# EAGLE design rf HD (EAGLE 9.0.1)
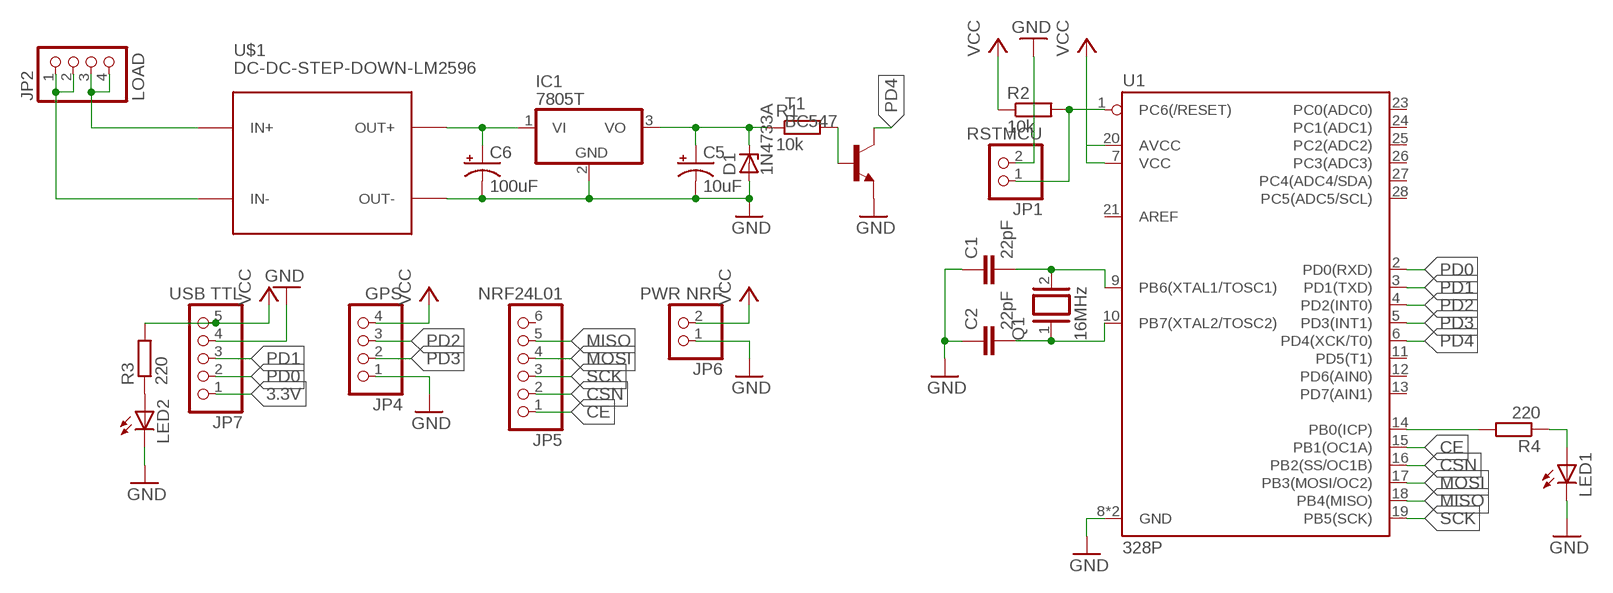
[diagram p0: schematic, sheet 1]

## Parts
C1  22pF  C-EU025-024X044  [C025-024X044]
C2  22pF  C-EU025-024X044  [C025-024X044]
C5  10uF  CPOL-USE2,5-6E  [E2,5-6E]
C6  100uF  CPOL-USE2.5-7  [E2,5-7]
D1  1N4733A  1N4728  [DO41Z10]
IC1  7805T  [TO220H]
JP1  RSTMCU  PINHD-1X2  [1X02]
JP2  LOAD  PINHD-1X4  [1X04]
JP4  GPS  PINHD-1X4  [1X04]
JP5  NRF24L01  PINHD-1X6  [1X06]
JP6  PWR NRF  PINHD-1X2  [1X02]
JP7  USB TTL  PINHD-1X5  [1X05]
LED1  LED3MM  [LED3MM]
LED2  LED3MM  [LED3MM]
Q1  16MHz  XTAL/S  [QS]
R1  10k  R-EU_0207/12  [0207/12]
R2  10k  R-EU_0207/12  [0207/12]
R3  220  R-EU_0207/12  [0207/12]
R4  220  R-EU_0207/12  [0207/12]
T1  BC547  [TO92]
U1  328P  ATMEGA328P_PDIP  [DIP28]
U$1  DC-DC-STEP-DOWN-LM2596  [DC-DC-STEP-DOWN-LM2596]

## Nets
3.3V: JP7.1
CE: JP5.1 U1.15(PB1(OC1A))
CSN: JP5.2 U1.16(PB2(SS/OC1B))
GND: C1.1 C2.1 C5.- C6.- D1.A IC1.2(GND) JP1.2 JP4.1 JP6.1 JP7.4 LED1.K(C) LED2.K(C) T1.1(E) U1.8(GND) U1.22(GND) U$1.OUT-
MISO: JP5.5 U1.18(PB4(MISO))
MOSI: JP5.4 U1.17(PB3(MOSI/OC2))
N$1: C1.2 Q1.2 U1.9(PB6(XTAL1/TOSC1))
N$2: C2.2 Q1.1 U1.10(PB7(XTAL2/TOSC2))
N$3: R1.2 T1.2(B)
N$4: JP1.1 R2.2 U1.1(PC6(/RESET))
N$5: JP2.3 JP2.4 U$1.IN+
N$6: C5.+ D1.C IC1.3(VO) R1.1
N$7: LED2.A R3.1
N$8: LED1.A R4.1
N$10: JP2.1 JP2.2 U$1.IN-
N$11: C6.+ IC1.1(VI) U$1.OUT+
PB0: R4.2 U1.14(PB0(ICP))
PD0: JP7.2 U1.2(PD0(RXD))
PD1: JP7.3 U1.3(PD1(TXD))
PD2: JP4.3 U1.4(PD2(INT0))
PD3: JP4.2 U1.5(PD3(INT1))
PD4: T1.3(C) U1.6(PD4(XCK/T0))
SCK: JP5.3 U1.19(PB5(SCK))
VCC: JP4.4 JP6.2 JP7.5 R2.1 R3.2 U1.7(VCC) U1.20(AVCC)
Unconnected: JP5.6 U1.11(PD5(T1)) U1.12(PD6(AIN0)) U1.13(PD7(AIN1)) U1.21(AREF) U1.23(PC0(ADC0)) U1.24(PC1(ADC1)) U1.25(PC2(ADC2)) U1.26(PC3(ADC3)) U1.27(PC4(ADC4/SDA)) U1.28(PC5(ADC5/SCL))

## Library data of the parts
C1 C2 = rcl:C-EU: CAPACITOR, European symbol; SPICEPREFIX: C
C5 C6 = rcl:CPOL-US: POLARIZED CAPACITOR, American symbol; SPICEPREFIX: C
D1 = diode:1N4728: Z DIODE 3.3 V, 1W, 5 percent
IC1 = linear:78*: Positive VOLTAGE REGULATOR Source: http://cache.national.com/ds/LM/LM78L05.pdf http://www.fairchildsemi.com/ds/LM/LM7805.pdf
JP1 JP6 = pinhead:PINHD-1X2: PIN HEADER
JP2 JP4 = pinhead:PINHD-1X4: PIN HEADER
JP5 = pinhead:PINHD-1X6: PIN HEADER
JP7 = pinhead:PINHD-1X5: PIN HEADER
LED1 LED2 = led:LED: LED OSRAM: - CHIPLED LG R971, LG N971, LY N971, LG Q971, LY Q971, LO R971, LY R971 LH N974, LH R974 LS Q976, LO Q976, LY Q976 LO Q996 - Hyper CHIPLED LW Q18S LB Q993, LB Q99A, LB R99A - SideLED LS A670, LO A670, LY A670, LG A670, LP A670 LB A673, LV A673, LT A673, LW A673 LH A674 LY A675 LS A676, LA A676, LO A676, LY A676, LW A676 LS A679, LY A679, LG A679 - Hyper Micro SIDELED® LS Y876, LA Y876, LO Y876, LY Y876 LT Y87S - SmartLED LW L88C, LW L88S LB L89C, LB L89S, LG L890 LS L89K, LO L89K, LY L89K LS L896, LA L896, LO L896, LY L896 - TOPLED LS T670, LO T670, LY T670, LG T670, LP T670 LSG T670, LSP T670, LSY T670, LOP T670, LYG T670 LG T671, LOG T671, LSG T671 LB T673, LV T673, LT T673, LW T673 LH T674 LS T676, LA T676, LO T676, LY T676, LB T676, LH T676, LSB T676, LW T676 LB T67C, LV T67C, LT T67C, LS T67K, LO T67K, LY T67K, LW E67C LS E67B, LA E67B, LO E67B, LY E67B, LB E67C, LV E67C, LT E67C LW T67C LS T679, LY T679, LG T679 LS T770, LO T770, LY T770, LG T770, LP T770 LB T773, LV T773, LT T773, LW T773 LH T774 LS E675, LA E675, LY E675, LS T675 LS T776, LA T776, LO T776, LY T776, LB T776 LHGB T686 LT T68C, LB T68C - Hyper Mini TOPLED® LB M676 - Mini TOPLED Santana® LG M470 LS M47K, LO M47K, LY M47K Source: http://www.osram.convergy.de LUXEON: - LUMILED® LXK2-PW12-R00, LXK2-PW12-S00, LXK2-PW14-U00, LXK2-PW14-V00 LXK2-PM12-R00, LXK2-PM12-S00, LXK2-PM14-U00 LXK2-PE12-Q00, LXK2-PE12-R00, LXK2-PE12-S00, LXK2-PE14-T00, LXK2-PE14-U00 LXK2-PB12-K00, LXK2-PB12-L00, LXK2-PB12-M00, LXK2-PB14-N00, LXK2-PB14-P00, LXK2-PB14-Q00 LXK2-PR12-L00, LXK2-PR12-M00, LXK2-PR14-Q00, LXK2-PR14-R00 LXK2-PD12-Q00, LXK2-PD12-R00, LXK2-PD12-S00 LXK2-PH12-R00, LXK2-PH12-S00 LXK2-PL12-P00, LXK2-PL12-Q00, LXK2-PL12-R00 Source: www.luxeon.com KINGBRIGHT: KA-3528ASYC Source: www.kingbright.com
Q1 = special:XTAL/S: CRYSTAL
R1-R4 = rcl:R-EU_: RESISTOR, European symbol; SPICEPREFIX: R
T1 = transistor:BC547: NPN TRANSISTOR
U1 = SparkFun-IC-Microcontroller:ATMEGA328P_PDIP: Atmel 328P Through hole ATMEGA328P uC used in the Arduino 32kb flash, 1k EEPROM, 2k SRAM Datasheet <http://www.sparkfun.com/datasheets/Components/SMD/ATMega328.pdf> SparkFun Products Storefront component: AVR 28 Pin 20MHz 32K 6A/D - ATMega328P <https://www.sparkfun.com/products/9061> (COM-09061) SparkFun Simon Says - Through-Hole Soldering Kit <https://www.sparkfun.com/products/10547> (KIT-10547) SparkFun Learn to Solder - Simon Says <https://www.sparkfun.com/products/13708> (KIT-13708) SparkFun BigTime Watch Kit <https://www.sparkfun.com/products/11734> (KIT-11734) SparkFun ClockIt <https://www.sparkfun.com/products/10930> (KIT-10930) SparkFun Serial Enabled LCD Kit <https://www.sparkfun.com/products/10097> (LCD-10097) SparkFun Simon Tilts - Through Hole Soldering Kit <https://www.sparkfun.com/products/12634> (KIT-12634) SparkFun Frequency Counter Kit <https://www.sparkfun.com/products/10140> (KIT-10140) FabFM Radio Kit <https://www.sparkfun.com/products/11043> (KIT-11043) SparkFun Binary Blaster Kit <https://www.sparkfun.com/products/12037> (KIT-12037) SparkFun Metro-Gnome <https://www.sparkfun.com/products/9236> (KIT-09236) ATmega328 with Arduino Optiboot (Uno) <https://www.sparkfun.com/products/10524> (DEV-10524); PROD_ID: IC-09136
U$1 = diy-modules:DC-DC-STEP-DOWN-LM2596: DC/DC Step-Down Regulator based on LM2596-ADJ chip LM2596 datasheet available here: http://www.ti.com/lit/ds/symlink/lm2596.pdf Click here to find device on ebay.com <http://www.ebay.com/sch/lm2596+power+regulator>

## Board
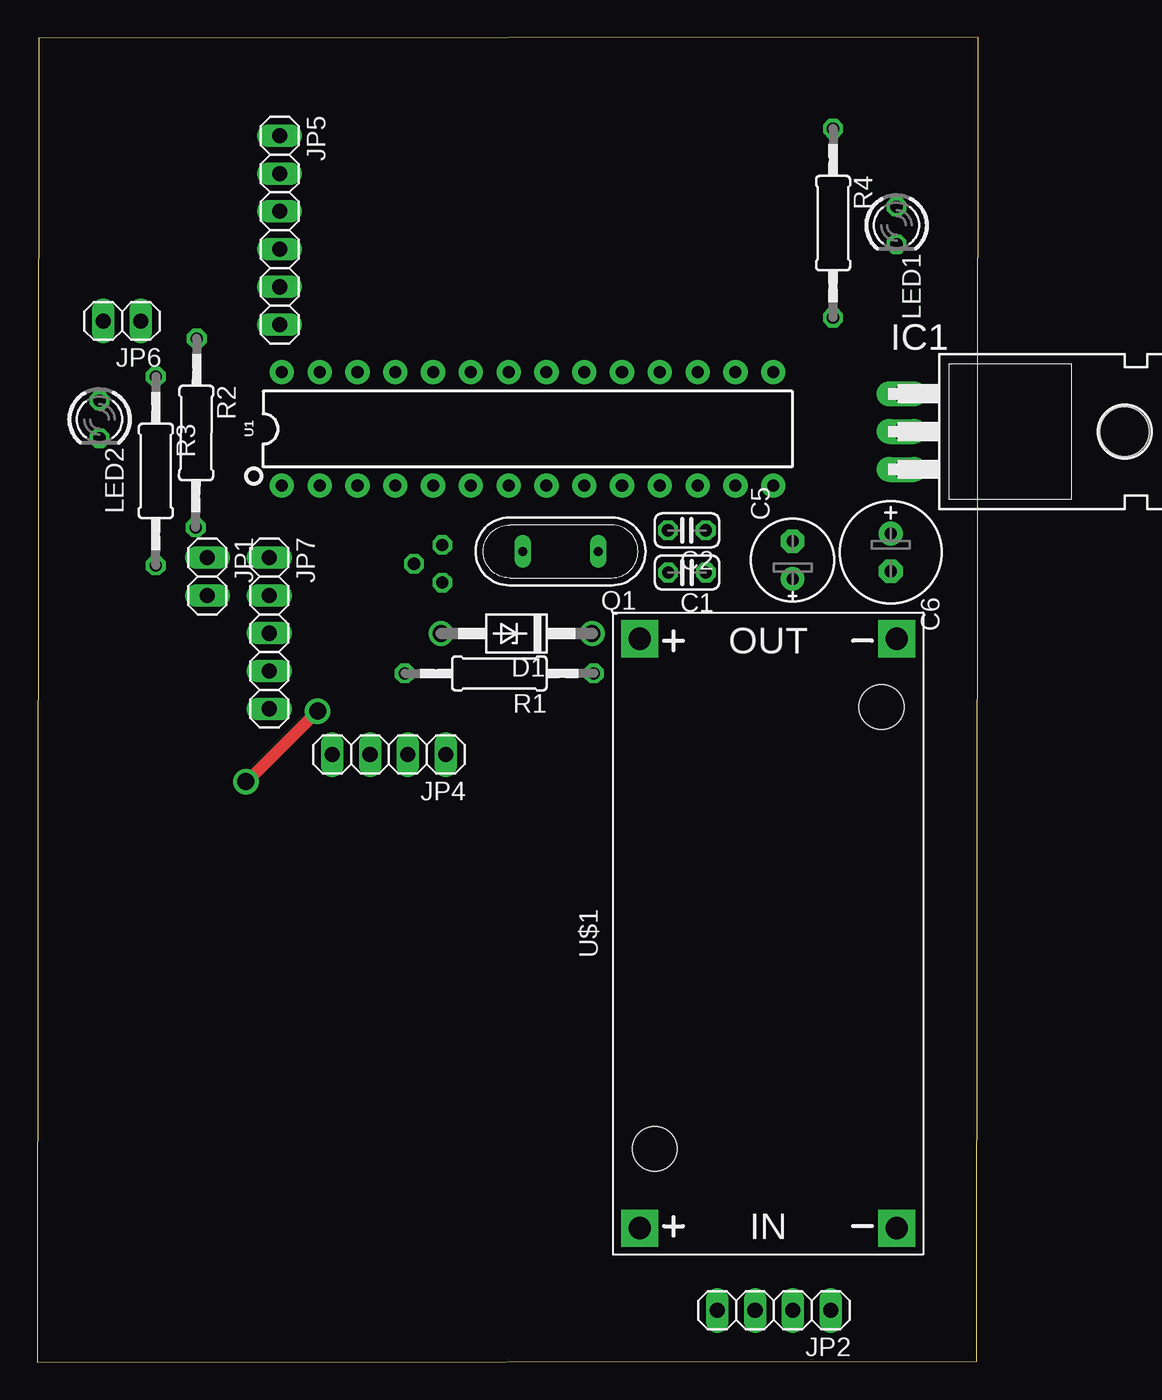
[diagram p1: board, top side]
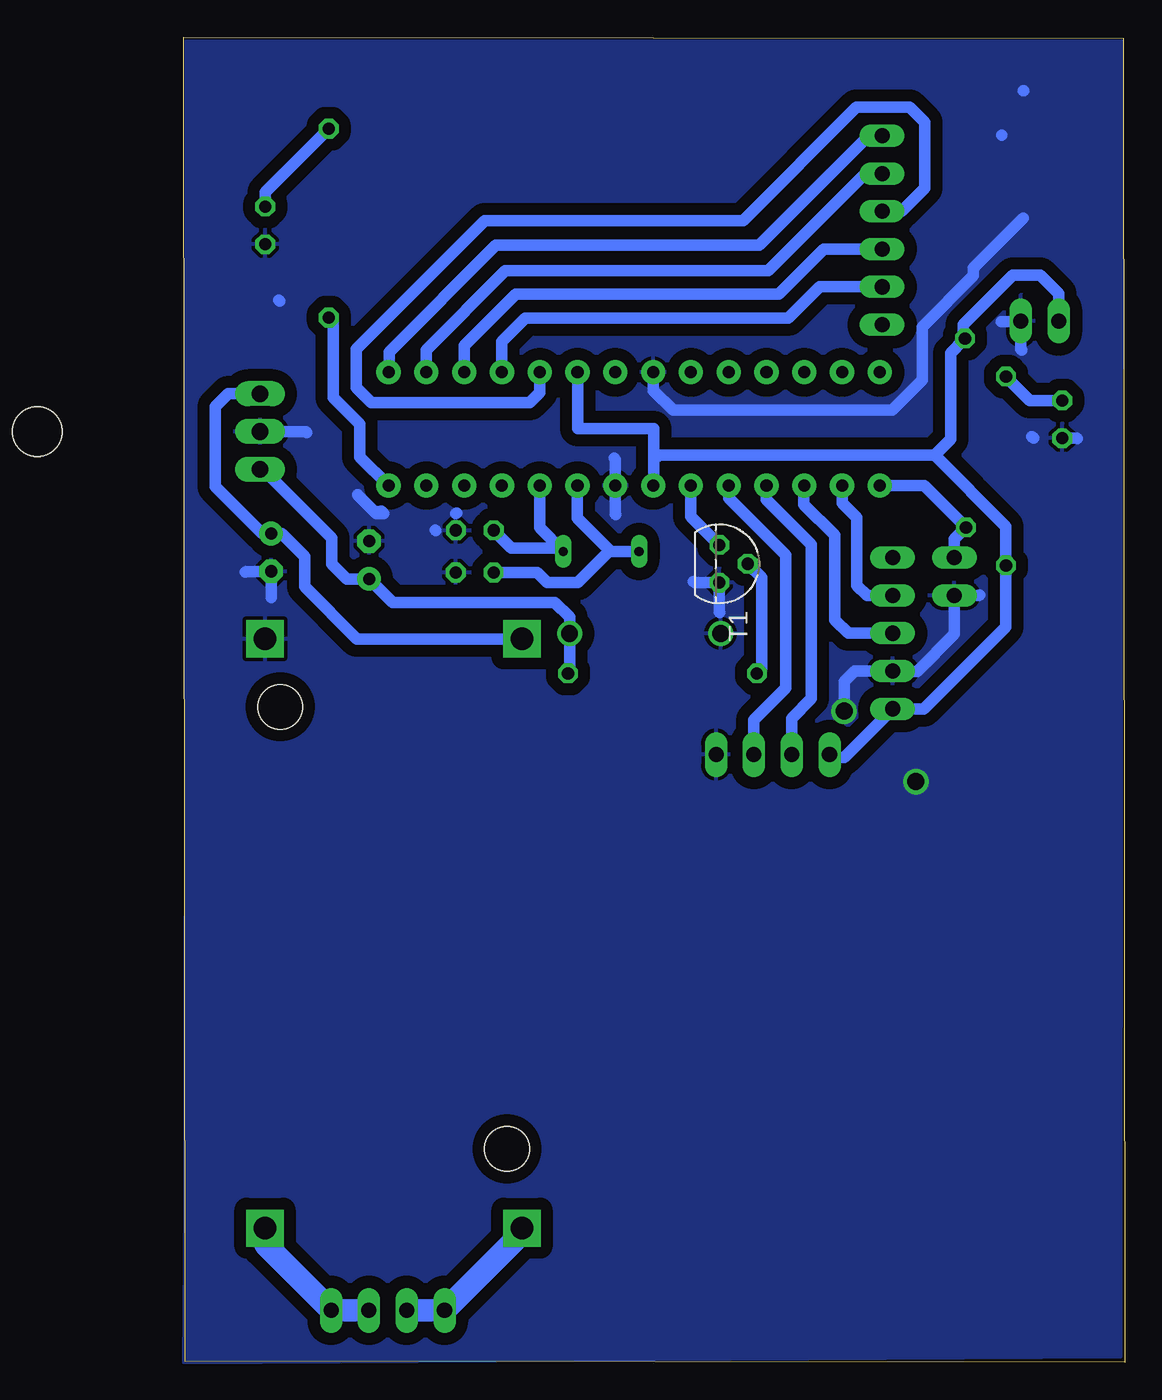
[diagram p2: board, bottom side, seen from below]

Size 63.24 x 89.09 mm. Coordinates in mm from the lower left corner, seen from the top.
Outline: 0,0 63.14,0.06 63.24,89.09 0.1,89.04 0,0
Copper layers (1*16): Top 0.035mm / dielectric 1.5mm / Bottom 0.035mm
Design rules "default *": minimum track width 30mil, minimum drill 1mm, track to track 8mil, track to pad 8mil, pad to pad 8mil, via to via 8mil, smd to smd 8mil, copper to edge 0mil, drill to drill 6mil, minimum pad ring 10mil, minimum via ring 8mil, stop-mask expansion 4mil, vias tented up to drill 0mil, thermal gap 10mil

### Footprints (pad centres in the part's own frame; a part is rotated, then mirrored left to right if it is on the bottom)
C025-024X044 = drill 0.813 octagon: 1 -1.27,0; 2 1.27,0
E2,5-6E = drill 0.813 pad 1.575: + -1.27,0 | drill 0.813 pad 1.575 octagon: - 1.27,0
E2,5-7 = drill 0.813 pad 1.6: + -1.27,0 | drill 0.813 pad 1.6 octagon: - 1.27,0
DO41Z10 = drill 1.118: A 5.08,0; C -5.08,0
TO220H = drill 1.118 long: 1 -2.54,-10.16; 2 0,-10.16; 3 2.54,-10.16 | hole 3.302: 0,4.826
1X02 = drill 1.016 long: 1 -1.27,0; 2 1.27,0
1X04 = drill 1.016 long: 1 -3.81,0; 2 -1.27,0; 3 1.27,0; 4 3.81,0
1X06 = drill 1.016 long: 1 -6.35,0; 2 -3.81,0; 3 -1.27,0; 4 1.27,0; 5 3.81,0; 6 6.35,0
1X05 = drill 1.016 long: 1 -5.08,0; 2 -2.54,0; 3 0,0; 4 2.54,0; 5 5.08,0
LED3MM = drill 0.813 octagon: A -1.27,0; K 1.27,0
QS = drill 0.61 long: 1 -2.54,0; 2 2.54,0
0207/12 = drill 0.813 octagon: 1 -6.35,0; 2 6.35,0
TO92 = drill 0.813 octagon: 1 1.27,0; 2 0,1.905; 3 -1.27,0
DIP28 = drill 0.813 pad 1.626: 1 -16.51,-3.81; 2 -13.97,-3.81; 3 -11.43,-3.81; 4 -8.89,-3.81; 5 -6.35,-3.81; 6 -3.81,-3.81; 7 -1.27,-3.81; 8 1.27,-3.81; 9 3.81,-3.81; 10 6.35,-3.81; 11 8.89,-3.81; 12 11.43,-3.81; 13 13.97,-3.81; 14 16.51,-3.81; 15 16.51,3.81; 16 13.97,3.81; 17 11.43,3.81; 18 8.89,3.81; 19 6.35,3.81; 20 3.81,3.81; 21 1.27,3.81; 22 -1.27,3.81; 23 -3.81,3.81; 24 -6.35,3.81; 25 -8.89,3.81; 26 -11.43,3.81; 27 -13.97,3.81; 28 -16.51,3.81
DC-DC-STEP-DOWN-LM2596 = drill 1.5 pad 2.5 square: IN+ -19.812,8.636; IN- -19.812,-8.636; OUT+ 19.812,8.636; OUT- 19.812,-8.636 | hole 3: -14.478,7.62; 15.24,-7.62

### Placement (x,y rotation side)
C1  43.68,53.1 180 top
C2  43.67,55.94 180 top
C5  50.77,53.94 90 top
C6  57.36,54.45 270 top
D1  32.22,49 180 top
IC1  68.25,62.58 270 top
JP1  11.44,52.83 270 top
JP2  49.51,3.49 180 top
JP4  23.64,40.86 180 top
JP5  16.29,76.12 270 top
JP6  5.7,70.01 180 top
JP7  15.59,49.02 270 top
LED1  57.75,76.44 270 top
LED2  4.19,63.4 270 top
Q1  35.17,54.52 180 top
R1  31.06,46.32 180 top
R2  10.69,62.48 269.7 top
R3  7.97,59.93 270 top
R4  53.49,76.59 270 top
T1  27.23,53.69 270 bottom
U1  32.96,62.76 0 top
U$1  49.13,28.83 90 top

### Tracks (layer width: path | path; a pad name or v marks a point on that pad's centre or on a via)
CE
  Bottom 0.762: U1.15 49.44,66.6 49.44,67.93 42.25,75.12 24.54,75.12 17.2,82.47 JP5.1
CSN
  Bottom 0.762: U1.16 46.95,66.59 46.95,68.06 41.61,73.39 23.96,73.39 17.42,79.93 JP5.2
GND  (via drill 1.14)
  Top 0.762: v18.84,43.79 14.1,39.05 v14.03,39.05
  Bottom 0.762: C1.1 44.97,52.77 45.12,52.93 | 44.94,53.11 C1.1 | 34.3,60.78 34.23,60.71 U1.8 34.23,57.03 34.18,56.98 | v18.84,43.79 18.84,45.78 18.14,46.48 JP7.4 15.57,46.45 13.94,46.45 11.44,48.96 JP1.2 9.8,51.56 9.76,51.6 9.74,51.6 | 6.79,76.93 10.15,73.57 10.15,73.06 13.61,69.61 13.61,66.02 15.63,64.01 30.35,64.01 31.69,65.34 U1.22 | 27.21,50.42 27.23,50.44 T1.1 28.89,52.41 28.98,52.5 | 8.25,82.51 8.26,82.5 | 6.79,85.49 | 6.1,62.13 6.23,62.25 | LED2.K 3.22,62.13 3.2,62.1 | 56.79,71.33 56.85,71.4 | C1.1 44.97,53.08 | 46.31,55.94 46.34,55.97 | 44.94,57.06 44.89,57.11 | 49.93,57.2 49.79,57.06 50.3,57.06 50.44,57.2 | 49.93,57.2 49.97,57.24 | 49.93,57.2 50.44,57.2 | 51.54,58.35 51.54,58.3 50.44,57.2 | 8.29,69.96 7.02,69.96 JP6.1 6.97,68.11 6.92,68.06 | IC1.2 55.03,62.58 54.97,62.52 | 59.09,53.12 59.03,53.18 C6.- 57.36,51.45 57.34,51.42
  pour Bottom (isolate 0.813): 0.28,0.38 63.2,-0.02 63.08,10.44 63.03,88.85 0.22,88.82
MISO
  Bottom 0.762: U1.18 41.87,66.59 41.87,68.62 40.27,70.22 22.59,70.22 20.5,72.31 JP5.5
MOSI
  Bottom 0.762: U1.17 44.39,68.36 40.93,71.82 23.25,71.82 20.22,74.85 JP5.4
N$1
  Bottom 0.762: Q1.2 34.54,54.52 | 34.54,54.52 36.77,56.75 U1.9 | C1.2 39.46,53.1 38.79,52.44 36.76,52.44 34.68,54.52 34.54,54.52
N$2
  Bottom 0.762: U1.10 39.31,56.11 Q1.1 37.95,54.75 41.21,54.75 C2.2
N$3
  Bottom 0.762: R1.2 24.39,46.63 24.39,52.75 T1.2
N$4
  Bottom 0.762: U1.1 13.47,58.95 R2.2 11.44,55.35 JP1.1
N$5
  Bottom 1.524: JP2.3 JP2.4 40.49,8.7 U$1.IN+
N$6
  Bottom 0.762: IC1.3 57.88,60.04 53.27,55.43 53.27,53.68 52.26,52.67 C5.+ 49.19,51.09 38.29,51.09 37.3,50.1 D1.C 37.3,46.43 R1.1
N$7
  Bottom 0.762: LED2.A 6.36,64.67 R3.1
N$8
  Bottom 0.762: LED1.A 57.75,78.67 R4.1
N$10
  Bottom 1.524: JP2.2 JP2.1 57.76,7.93 U$1.IN-
N$11
  Bottom 0.762: IC1.1 60.25,65.12 61.12,64.25 61.12,58.89 57.95,55.72 C6.+ | 57.33,55.69 C6.+ | C6.+ 56.63,55.72 55.1,54.19 55.1,52.16 51.59,48.64 U$1.OUT+
PB0
  Bottom 0.762: U1.14 51.39,60.87 51.39,63.08 53.17,64.86 53.17,69.92 R4.2
PD0
  Bottom 0.762: U1.2 18.99,57.77 17.99,56.78 17.99,52.23 17.3,51.55 15.6,51.55 JP7.2
PD1
  Bottom 0.762: JP7.3 18.57,49.02 19.48,49.92 19.48,55.61 21.55,57.68 21.55,58.92 U1.3
PD2
  Bottom 0.762: U1.4 24.07,58 21.04,54.98 21.04,44.62 22.37,43.29 JP4.3
PD3
  Bottom 0.762: 24.26,55.75 22.78,54.27 22.78,45.33 24.91,43.2 JP4.2 | 24.26,55.75 24.33,55.82 | 24.26,55.75 26.61,58.09 U1.5
PD4
  Bottom 0.762: T1.3 29.15,56.87 U1.6
SCK
  Bottom 0.762: 39.33,66.59 U1.19 39.31,65.21 39.99,64.53 50.63,64.53 51.65,65.54 51.65,68.13 43.01,76.77 25.64,76.77 18.02,84.39 14.43,84.39 13.42,83.37 13.42,78.95 14.99,77.39 JP5.3
VCC
  Bottom 0.762: U1.20 36.77,62.79 31.66,62.79 31.66,60.98 | 31.66,60.98 31.66,58.95 U1.7 | 31.66,60.98 31.49,60.82 31.32,60.99 12.77,60.99 | R2.1 10.83,68.72 | 10.83,68.72 11.69,67.86 11.69,62.06 12.77,60.99 | 12.77,60.99 7.97,56.19 R3.2 7.97,49.45 13.48,43.94 JP7.5 18.85,40.68 19.64,40.68 JP4.4 | JP6.2 4.43,71.85 5.67,73.09 7.53,73.09 10.83,69.78 10.83,68.72